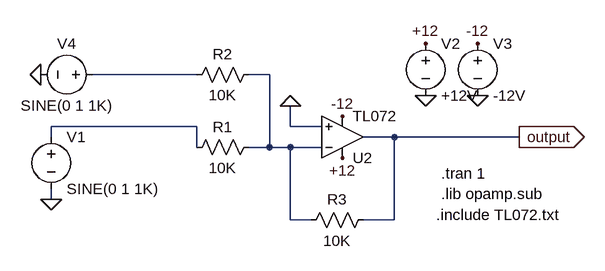
[diagram p0: schematic SUMMING AMPLIFIER.asc]
SUMMING AMPLIFIER.asc, the LTspice schematic file:
Version 4
SHEET 1 880 680
WIRE 176 48 16 48
WIRE 288 48 256 48
WIRE 176 128 -48 128
WIRE 320 128 320 96
WIRE 368 128 320 128
WIRE -48 144 -48 128
WIRE 480 144 432 144
WIRE 672 144 480 144
WIRE 176 160 176 128
WIRE 288 160 288 48
WIRE 288 160 256 160
WIRE 320 160 288 160
WIRE 368 160 320 160
WIRE -48 240 -48 224
WIRE 320 272 320 160
WIRE 352 272 320 272
WIRE 480 272 480 144
WIRE 480 272 432 272
FLAG 672 144 output
IOPIN 672 144 Out
FLAG -48 240 0
FLAG 400 112 -12
FLAG 400 176 +12
FLAG 528 80 0
FLAG 608 80 0
FLAG 528 0 +12
FLAG 608 0 -12
FLAG 320 96 0
FLAG -64 48 0
SYMBOL Opamps\\opamp2 400 208 M180
SYMATTR InstName U2
SYMATTR Value TL072
SYMBOL voltage 528 -16 R0
SYMATTR InstName V2
SYMATTR Value +12V
SYMBOL voltage 608 -16 R0
SYMATTR InstName V3
SYMATTR Value -12V
SYMBOL res 272 144 R90
WINDOW 0 0 56 VBottom 2
WINDOW 3 32 56 VTop 2
SYMATTR InstName R1
SYMATTR Value 10K
SYMBOL res 272 32 R90
WINDOW 0 0 56 VBottom 2
WINDOW 3 32 56 VTop 2
SYMATTR InstName R2
SYMATTR Value 10K
SYMBOL res 448 256 R90
WINDOW 0 0 56 VBottom 2
WINDOW 3 32 56 VTop 2
SYMATTR InstName R3
SYMATTR Value 10K
SYMBOL voltage 32 48 R90
WINDOW 0 -32 56 VBottom 2
WINDOW 3 32 56 VTop 2
WINDOW 123 0 0 Left 2
WINDOW 39 0 0 Left 2
SYMATTR InstName V4
SYMATTR Value SINE(0 1 1K)
SYMBOL voltage -48 128 R0
WINDOW 123 0 0 Left 2
WINDOW 39 0 0 Left 2
SYMATTR InstName V1
SYMATTR Value SINE(0 1 1K)
TEXT 552 200 Left 2 !.tran 1
TEXT 552 232 Left 2 !.lib opamp.sub
TEXT 544 264 Left 2 !.include TL072.txt

The netlist it stands for:
* SUMMING AMPLIFIER.asc
XU2 0 N002 +12 -12 output TL072  ; pins In+ In- V+ V- OUT
V2 +12 0 +12V
V3 -12 0 -12V
R1 N002 N003 10K
R2 N002 N001 10K
R3 output N002 10K
V4 N001 0 SINE(0 1 1K)
V1 N003 0 SINE(0 1 1K)
.tran 1
.lib opamp.sub
.include TL072.txt
.backanno
.end